# Altium schematic sheet dclass.SCHDOC
size B
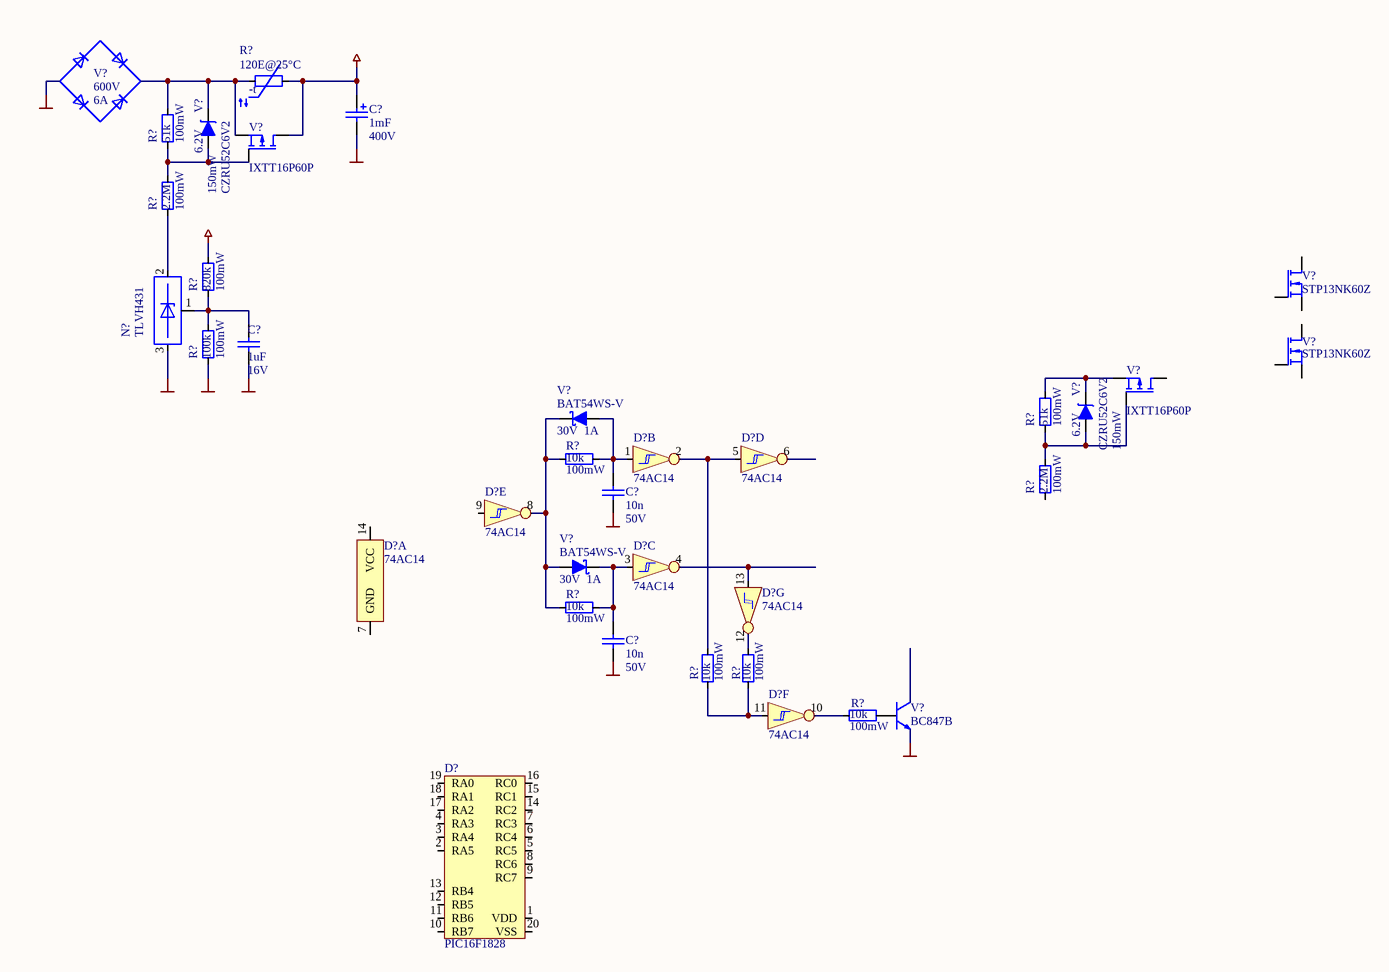
[diagram p0: dclass.SCHDOC]

## Parts
(Parts that share a designator on the sheet are numbered #1, #2 ... from top to bottom, then left to right.)
C?#1  value 1mF  Value2: 400V  [THT_CAP_T2GP102FA]  (hidden comment: C_THT_ALU_1000U_400V_20%_T2GP102FA)
C?#2  value 1uF  Value2: 16V  [SMD_0603]  (hidden comment: C_SMD_CER_1U_16V_10%_X5R_0603)
C?#3  value 10n  Value2: 50V  [SMD_0603]  (hidden comment: C_SMD_CER_10N_50V_10%_X7R_0603)
C?#4  value 10n  Value2: 50V  [SMD_0603]  (hidden comment: C_SMD_CER_10N_50V_10%_X7R_0603)
D?#1  74AC14  [SMD_TSSOP_14]  (part B of 7)
D?#2  74AC14  [SMD_TSSOP_14]  (part D of 7)
D?#3  74AC14  [SMD_TSSOP_14]  (part E of 7)
D?#4  74AC14  [SMD_TSSOP_14]  (part A of 7)
D?#5  74AC14  [SMD_TSSOP_14]  (part C of 7)
D?#6  74AC14  [SMD_TSSOP_14]  (part G of 7)
D?#7  74AC14  [SMD_TSSOP_14]  (part F of 7)
D?#8  D_PIC16F1828_SSOP-20  [SMD_SSOP_20]  (value not drawn)
N?  Type: TLVH431  [SMD_SOT_23_3]  (hidden comment: N_TLVH431_SOT23-3)
R?#1  value 120E@25°C  [THT_R_A_L17.5_D6_P10]  (hidden comment: R_THT_NTC_120E_20%)
R?#2  value 51k  Value2: 100mW  [SMD_0603]  (hidden comment: R_SMD_THINFILM_51K_0W1_1%_50PPM_0603)
R?#3  value 2.2M  Value2: 100mW  [SMD_0603]  (hidden comment: R_SMD_THINFILM_2M2_0W1_1%_50PPM_0603)
R?#4  value 820k  Value2: 100mW  [SMD_0603]  (hidden comment: R_SMD_THINFILM_820K_0W1_1%_100PPM_0603)
R?#5  value 100k  Value2: 100mW  [SMD_0603]  (hidden comment: R_SMD_THINFILM_100K_0W1_1%_50PPM_0603)
R?#6  value 51k  Value2: 100mW  [SMD_0603]  (hidden comment: R_SMD_THINFILM_51K_0W1_1%_50PPM_0603)
R?#7  value 10k  Value2: 100mW  [SMD_0603]  (hidden comment: R_SMD_THINFILM_10K_0W1_1%_50PPM_0603)
R?#8  value 2.2M  Value2: 100mW  [SMD_0603]  (hidden comment: R_SMD_THINFILM_2M2_0W1_1%_50PPM_0603)
R?#9  value 10k  Value2: 100mW  [SMD_0603]  (hidden comment: R_SMD_THINFILM_10K_0W1_1%_50PPM_0603)
R?#10  value 10k  Value2: 100mW  [SMD_0603]  (hidden comment: R_SMD_THINFILM_10K_0W1_1%_50PPM_0603)
R?#11  value 10k  Value2: 100mW  [SMD_0603]  (hidden comment: R_SMD_THINFILM_10K_0W1_1%_50PPM_0603)
R?#12  value 10k  Value2: 100mW  [SMD_0603]  (hidden comment: R_SMD_THINFILM_10K_0W1_1%_50PPM_0603)
V?#1  value 600V  Value2: 6A  [THT_KBU6J]  (hidden comment: V_THT_BRIDGE_RECTIFIER_KBU6J_600V_6A_KBU)
V?#2  Type: IXTT16P60P  [SMD_TO-268-3]  (hidden comment: V_SMD_FET_IXTT16P60P_PMOS_600V_16A_92NC_460W_TO-268-3)
V?#3  value 6.2V  Value2: 150mW  Type: CZRU52C6V2  [SMD_0603P]  (hidden comment: V_SMD_Z-DIODE_CZRU52C6V2_6V2_0W15_5%_0603)
V?#4  Type: STP13NK60Z  [THT_TO_220]  (hidden comment: V_THT_FET_NMOS_STP13NK60Z_600V_13A_92NC_150W_TO-220)
V?#5  Type: IXTT16P60P  [SMD_TO-268-3]  (hidden comment: V_SMD_FET_IXTT16P60P_PMOS_600V_16A_92NC_460W_TO-268-3)
V?#6  Type: STP13NK60Z  [THT_TO_220]  (hidden comment: V_THT_FET_NMOS_STP13NK60Z_600V_13A_92NC_150W_TO-220)
V?#7  value 30V  Type: BAT54WS-V  Value2: 1A  [SMD_SOD_323]  (hidden comment: V_SMD_SCHOTTKY_BAT54WS-V_30V_1A_SOD-323)
V?#8  value 6.2V  Value2: 150mW  Type: CZRU52C6V2  [SMD_0603P]  (hidden comment: V_SMD_Z-DIODE_CZRU52C6V2_6V2_0W15_5%_0603)
V?#9  value 30V  Type: BAT54WS-V  Value2: 1A  [SMD_SOD_323]  (hidden comment: V_SMD_SCHOTTKY_BAT54WS-V_30V_1A_SOD-323)
V?#10  Type: BC847B  [SMD_SOT_23_3]  (hidden comment: V_SMD_TRANS_NPN_BC847B_50V_0A2_SOT-23-3)

## Nets
+12V: R?#4.2
+325V: C?#1.2 R?#1.2 V?#2.2(Drain)
GND: C?#1.1 C?#2.1 C?#3.1 C?#4.1 N?.3 R?#5.1 V?#1.4 V?#10.2(E)
NetC?#2_2: C?#2.2 N?.1 R?#4.1 R?#5.2
NetC?#3_2: C?#3.2 D?#1.1(1A) R?#7.2 V?#7.1
NetC?#4_2: C?#4.2 D?#5.3(2A) R?#9.2 V?#9.2
NetD?#1_2: D?#1.2(1Y) D?#2.5(3A) R?#10.2
NetD?#3_8: D?#3.8(4Y) R?#7.1 R?#9.1 V?#7.2 V?#9.1
NetD?#5_4: D?#5.4(2Y) D?#6.13(6A)
NetD?#6_12: D?#6.12(6Y) R?#11.2
NetD?#7_10: D?#7.10(5Y) R?#12.2
NetD?#7_11: D?#7.11(5A) R?#10.1 R?#11.1
NetN?_2: N?.2 R?#3.1
NetR?#1_1: R?#1.1 R?#2.2 V?#1.1 V?#2.3(Source) V?#3.2
NetR?#2_1: R?#2.1 R?#3.2 V?#2.1(Gate) V?#3.1
NetR?#6_1: R?#6.1 R?#8.2 V?#5.1(Gate) V?#8.1
NetR?#6_2: R?#6.2 V?#5.3(Source) V?#8.2
NetR?#12_1: R?#12.1 V?#10.1(B)

Not connected (* = marked no-connect by the designer): C?#1 3 4; D?#2 6(3Y); D?#3 9(4A); D?#4 7(GND) 14(VCC); D?#8 1(VDD) 2(RA5) 3(RA4) 4(RA3) 5(RC5) 6(RC4) 7(RC3) 8(RC6) 9(RC7) 10(RB7) 11(RB6) 12(RB5) 13(RB4) 14(RC2) 15(RC1) 16(RC0) 17(RA2) 18(RA1) 19(RA0) 20(VSS); R?#8 1; V?#1 2 3; V?#4 1(Gate) 2(Drain) 3(Source); V?#5 2(Drain); V?#6 1(Gate) 2(Drain) 3(Source); V?#10 3(C)

## Notes on the sheet
- (in symbol R_THT_NTC_120E_20%) -t

## Library data of the parts
C?#1 = C_THT_ALU_1000U_400V_20%_T2GP102FA: THT Aluminum capacitor; Type: ECE-T2GP102FA; Supplier - Digikey: P10064-ND
C?#2 = C_SMD_CER_1U_16V_10%_X5R_0603: SMD Capacitor; Supplier - E+H-flowtec SAP: 50106956
C?#3 C?#4 = C_SMD_CER_10N_50V_10%_X7R_0603: SMD Capacitor; Supplier - E+H-flowtec SAP: 50092743
D?#1-D?#7 = D_74AC14_TSSOP-14: HEX SCHMITT-TRIGGER INVERTERS; Supplier - DigiKey: 296-4302-1-ND; Type: 74AC14
D?#8 = D_PIC16F1828_SSOP-20: PIC16F1828; Supplier - Digikey: PIC16F1828-I/SS-ND; Type: PIC16F1828
N? = N_TLVH431_SOT23-3: LOW-VOLTAGE ADJUSTABLE PRECISION SHUNT REGULATORS; Supplier - E+H-flowtec SAP: 71120701
R?#1 = R_THT_NTC_120E_20%: CURRENT LIMITER INRUSH 120OHM 20%; Supplier - Digikey: 317-1221-ND
R?#2 R?#6 = R_SMD_THINFILM_51K_0W1_1%_50PPM_0603: SMD Resistor; Supplier - E+H-flowtec SAP: 50092709
R?#3 R?#8 = R_SMD_THINFILM_2M2_0W1_1%_50PPM_0603: SMD Resistor; Supplier - E+H-flowtec SAP: 50092790
R?#4 = R_SMD_THINFILM_820K_0W1_1%_100PPM_0603: SMD Resistor; Supplier - E+H-flowtec SAP: 71211650
R?#5 = R_SMD_THINFILM_100K_0W1_1%_50PPM_0603: SMD Resistor; Supplier - E+H-flowtec SAP: 50092714
R?#7 R?#9-R?#12 = R_SMD_THINFILM_10K_0W1_1%_50PPM_0603: SMD Resistor; Supplier - E+H-flowtec SAP: 50092700
V?#1 = V_THT_BRIDGE_RECTIFIER_KBU6J_600V_6A_KBU: Bridge Recitifer; Type: KBU6J; Supplier - E+H-flowtec SAP: 71025862
V?#2 V?#5 = V_SMD_FET_PMOS_600V_16A_92NC_460W_TO-268-3: P-Channel Power MOSFET; Supplier - Digikey: IXTT16P60P-ND
V?#3 V?#8 = V_SMD_Z-DIODE_CZRU52C6V2_6V2_0W15_5%_0603: Zener Diode, 6.2V; Supplier - Digikey: 641-1031-1-ND
V?#4 V?#6 = V_THT_FET_NMOS_STP13NK60Z_600V_13A_92NC_150W_TO-220: Value: 600V; Value2: 13A; Supplier - Digikey: 497-3182-5-ND
V?#7 V?#9 = V_SMD_SCHOTTKY_BAT54WS-V_30V_1A_SOD-323: SMD Schottky; Supplier - Digikey: BAT54WS-V-GS18CT-ND
V?#10 = V_SMD_TRANS_NPN_BC847B_50V_0A2_SOT-23-3: NPN Transistor; Supplier - E+H-flowtec SAP: 50019820